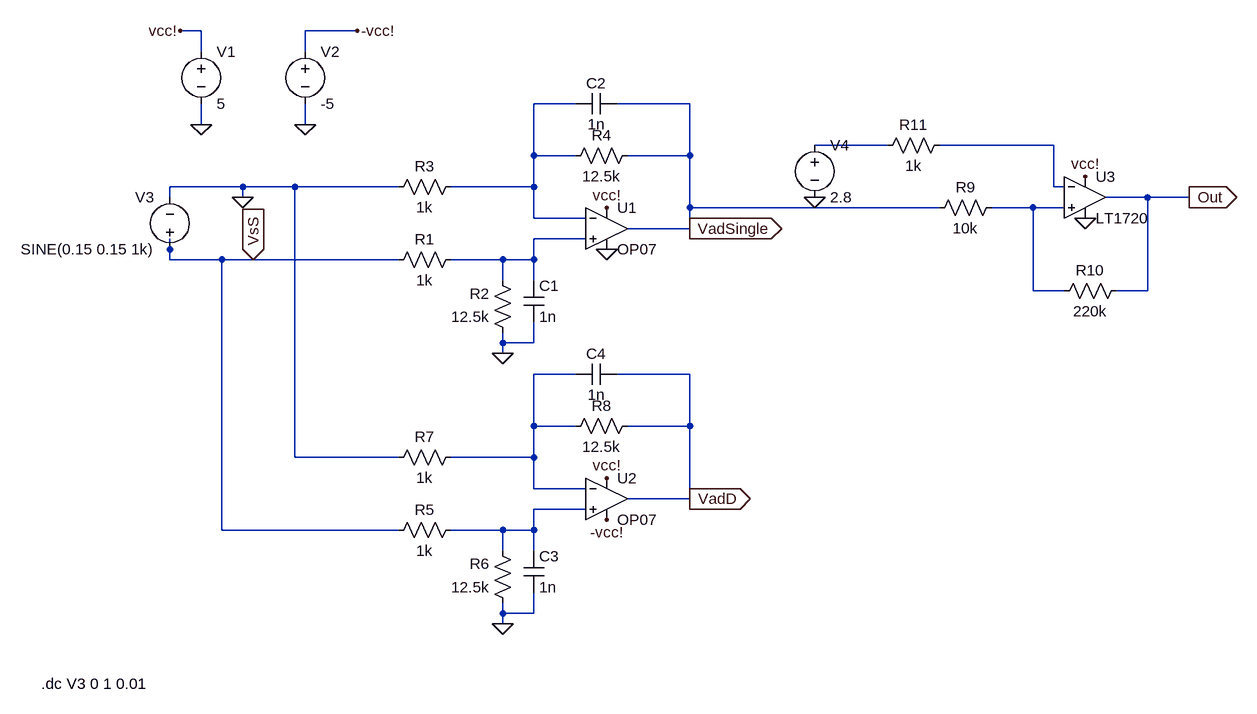
[diagram p0: schematic DCSweep.asc]
DCSweep.asc, the LTspice schematic file:
Version 4
SHEET 1 1056 732
WIRE -560 -288 -592 -288
WIRE -320 -288 -400 -288
WIRE -560 -256 -560 -288
WIRE -400 -256 -400 -288
WIRE 16 -176 -48 -176
WIRE 192 -176 80 -176
WIRE -560 -144 -560 -176
WIRE -400 -144 -400 -176
WIRE 496 -112 384 -112
WIRE 752 -112 576 -112
WIRE -48 -96 -48 -176
WIRE 16 -96 -48 -96
WIRE 192 -96 192 -176
WIRE 192 -96 96 -96
WIRE -496 -48 -608 -48
WIRE -416 -48 -496 -48
WIRE -256 -48 -416 -48
WIRE -48 -48 -48 -96
WIRE -48 -48 -176 -48
WIRE 752 -48 752 -112
WIRE 768 -48 752 -48
WIRE -608 -32 -608 -48
WIRE -496 -32 -496 -48
WIRE 896 -32 832 -32
WIRE 960 -32 896 -32
WIRE 192 -16 192 -96
WIRE 576 -16 192 -16
WIRE 720 -16 656 -16
WIRE 768 -16 720 -16
WIRE -48 0 -48 -48
WIRE 32 0 -48 0
WIRE 192 16 192 -16
WIRE 192 16 96 16
WIRE 32 32 -48 32
WIRE -608 48 -608 32
WIRE -608 64 -608 48
WIRE -528 64 -608 64
WIRE -480 64 -528 64
WIRE -256 64 -480 64
WIRE -96 64 -176 64
WIRE -48 64 -48 32
WIRE -48 64 -96 64
WIRE -96 96 -96 64
WIRE -48 96 -48 64
WIRE 720 112 720 -16
WIRE 768 112 720 112
WIRE 896 112 896 -32
WIRE 896 112 848 112
WIRE -96 192 -96 176
WIRE -48 192 -48 160
WIRE -48 192 -96 192
WIRE -96 208 -96 192
WIRE 16 240 -48 240
WIRE 192 240 80 240
WIRE -48 320 -48 240
WIRE 16 320 -48 320
WIRE 192 320 192 240
WIRE 192 320 96 320
WIRE -416 368 -416 -48
WIRE -256 368 -416 368
WIRE -48 368 -48 320
WIRE -48 368 -176 368
WIRE -48 416 -48 368
WIRE 32 416 -48 416
WIRE 192 432 192 320
WIRE 192 432 96 432
WIRE 32 448 -48 448
WIRE -528 480 -528 64
WIRE -256 480 -528 480
WIRE -96 480 -176 480
WIRE -48 480 -48 448
WIRE -48 480 -96 480
WIRE -96 512 -96 480
WIRE -48 512 -48 480
WIRE -96 608 -96 592
WIRE -48 608 -48 576
WIRE -48 608 -96 608
WIRE -96 624 -96 608
FLAG -96 208 0
FLAG -560 -144 0
FLAG -592 -288 vcc!
FLAG 64 -16 vcc!
FLAG -400 -144 0
FLAG -320 -288 -vcc!
FLAG 192 16 VadSingle
IOPIN 192 16 Out
FLAG -496 -32 0
FLAG -96 624 0
FLAG 64 400 vcc!
FLAG 192 432 VadD
IOPIN 192 432 Out
FLAG 64 464 -vcc!
FLAG 64 48 0
FLAG -480 64 VsS
IOPIN -480 64 In
FLAG 800 -64 vcc!
FLAG 800 0 0
FLAG 960 -32 Out
IOPIN 960 -32 Out
FLAG 384 -32 0
SYMBOL res -160 48 R90
WINDOW 0 0 56 VBottom 2
WINDOW 3 32 56 VTop 2
SYMATTR InstName R1
SYMATTR Value 1k
SYMBOL res -80 192 R180
WINDOW 0 36 76 Left 2
WINDOW 3 36 40 Left 2
SYMATTR InstName R2
SYMATTR Value 12.5k
SYMBOL res -160 -64 R90
WINDOW 0 0 56 VBottom 2
WINDOW 3 32 56 VTop 2
SYMATTR InstName R3
SYMATTR Value 1k
SYMBOL res 112 -112 R90
WINDOW 0 0 56 VBottom 2
WINDOW 3 32 56 VTop 2
SYMATTR InstName R4
SYMATTR Value 12.5k
SYMBOL voltage -560 -272 R0
WINDOW 123 0 0 Left 2
WINDOW 39 0 0 Left 2
SYMATTR InstName V1
SYMATTR Value 5
SYMBOL Opamps\\OP07 64 -48 R0
SYMATTR InstName U1
SYMBOL cap -64 96 R0
SYMATTR InstName C1
SYMATTR Value 1n
SYMBOL cap 80 -192 R90
WINDOW 0 0 32 VBottom 2
WINDOW 3 32 32 VTop 2
SYMATTR InstName C2
SYMATTR Value 1n
SYMBOL voltage -400 -272 R0
WINDOW 123 0 0 Left 2
WINDOW 39 0 0 Left 2
SYMATTR InstName V2
SYMATTR Value -5
SYMBOL voltage -608 64 R180
WINDOW 0 24 96 Left 2
WINDOW 3 24 16 Left 2
WINDOW 123 0 0 Left 2
WINDOW 39 0 0 Left 2
SYMATTR InstName V3
SYMATTR Value SINE(0.15 0.15 1k)
SYMBOL res -160 464 R90
WINDOW 0 0 56 VBottom 2
WINDOW 3 32 56 VTop 2
SYMATTR InstName R5
SYMATTR Value 1k
SYMBOL res -80 608 R180
WINDOW 0 36 76 Left 2
WINDOW 3 36 40 Left 2
SYMATTR InstName R6
SYMATTR Value 12.5k
SYMBOL res -160 352 R90
WINDOW 0 0 56 VBottom 2
WINDOW 3 32 56 VTop 2
SYMATTR InstName R7
SYMATTR Value 1k
SYMBOL res 112 304 R90
WINDOW 0 0 56 VBottom 2
WINDOW 3 32 56 VTop 2
SYMATTR InstName R8
SYMATTR Value 12.5k
SYMBOL Opamps\\OP07 64 368 R0
SYMATTR InstName U2
SYMBOL cap -64 512 R0
SYMATTR InstName C3
SYMATTR Value 1n
SYMBOL cap 80 224 R90
WINDOW 0 0 32 VBottom 2
WINDOW 3 32 32 VTop 2
SYMATTR InstName C4
SYMATTR Value 1n
SYMBOL res 672 -32 R90
WINDOW 0 0 56 VBottom 2
WINDOW 3 32 56 VTop 2
SYMATTR InstName R9
SYMATTR Value 10k
SYMBOL Comparators\\LT1720 800 -96 R0
SYMATTR InstName U3
SYMBOL res 864 96 R90
WINDOW 0 0 56 VBottom 2
WINDOW 3 32 56 VTop 2
SYMATTR InstName R10
SYMATTR Value 220k
SYMBOL res 592 -128 R90
WINDOW 0 0 56 VBottom 2
WINDOW 3 32 56 VTop 2
SYMATTR InstName R11
SYMATTR Value 1k
SYMBOL voltage 384 -128 R0
WINDOW 123 0 0 Left 2
WINDOW 39 0 0 Left 2
SYMATTR InstName V4
SYMATTR Value 2.8
TEXT -806 716 Left 2 !.dc V3 0 1 0.01

The netlist it stands for:
* DCSweep.asc
R1 N005 VsS 1k
R2 0 N005 12.5k
R3 N001 0 1k
R4 VadSingle N001 12.5k
V1 vcc! 0 5
XU1 N005 N001 vcc! 0 VadSingle LT1001  ; OP07, pins In+ In- V+ V- OUT
C1 N005 0 1n
C2 VadSingle N001 1n
V2 -vcc! 0 -5
V3 VsS 0 SINE(0.15 0.15 1k)
R5 N007 VsS 1k
R6 0 N007 12.5k
R7 N006 0 1k
R8 VadD N006 12.5k
XU2 N007 N006 vcc! -vcc! VadD LT1001  ; OP07, pins In+ In- V+ V- OUT
C3 N007 0 1n
C4 VadD N006 1n
R9 N004 VadSingle 10k
XU3 N004 N003 vcc! 0 Out LT1720  ; pins In+ In- V+ V- OUT
R10 Out N004 220k
R11 N003 N002 1k
V4 N002 0 2.8
.dc V3 0 1 0.01
.lib LTC.lib
.lib LT1720.sub
.backanno
.end

* Results of the author's LTspice run, read from the files saved beside the schematic
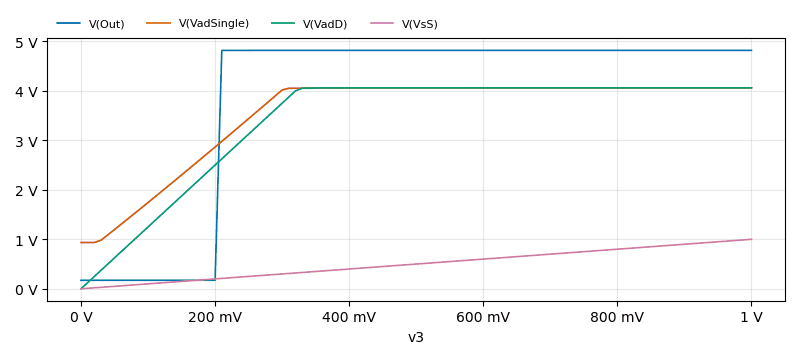
[diagram p1: DC transfer characteristic of DCSweep.asc, plotted from the saved traces]
* DC transfer characteristic, 1 run:
*   V(Out): 172.2 mV at v3=0 V, 4.817 V at v3=1 V, min 172.2 mV, max 4.817 V
*   V(VadSingle): 935.1 mV at v3=0 V, 4.06 V at v3=1 V, min 935.1 mV, max 4.06 V
*   V(VadD): 0 V at v3=0 V, 4.06 V at v3=1 V, min 0 V, max 4.06 V
*   V(VsS): 0 V at v3=0 V, 1 V at v3=1 V, min 0 V, max 1 V